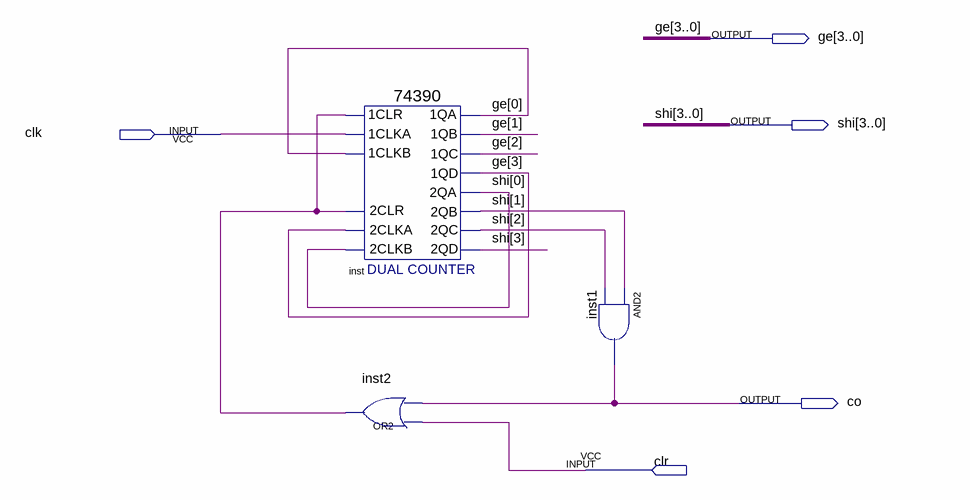
[diagram p0: schematic sheet]
// Quartus schematic Ucnt60.bdf as structural Verilog: 3 symbols, 5 pins
module Ucnt60 (
  input  clk,
  input  clr,
  output [3:0] ge,
  output [3:0] shi,
  output co
);

  wire inst2_out;

  \74390  inst (
    .\2CLKA (ge[3]), .\2CLR (inst2_out), .\2CLKB (shi[0]), .\1CLR (inst2_out), .\1CLKA (clk),
    .\1CLKB (ge[0]), .\1QA (ge[0]), .\1QB (ge[1]), .\1QC (ge[2]), .\1QD (ge[3]), .\2QA (shi[0]),
    .\2QB (shi[1]), .\2QC (shi[2]), .\2QD (shi[3]));
  or inst2 (inst2_out, clr, co);
  and inst1 (co, shi[1], shi[2]);
endmodule
